# EAGLE schematic madrack (EAGLE 9.3.1)
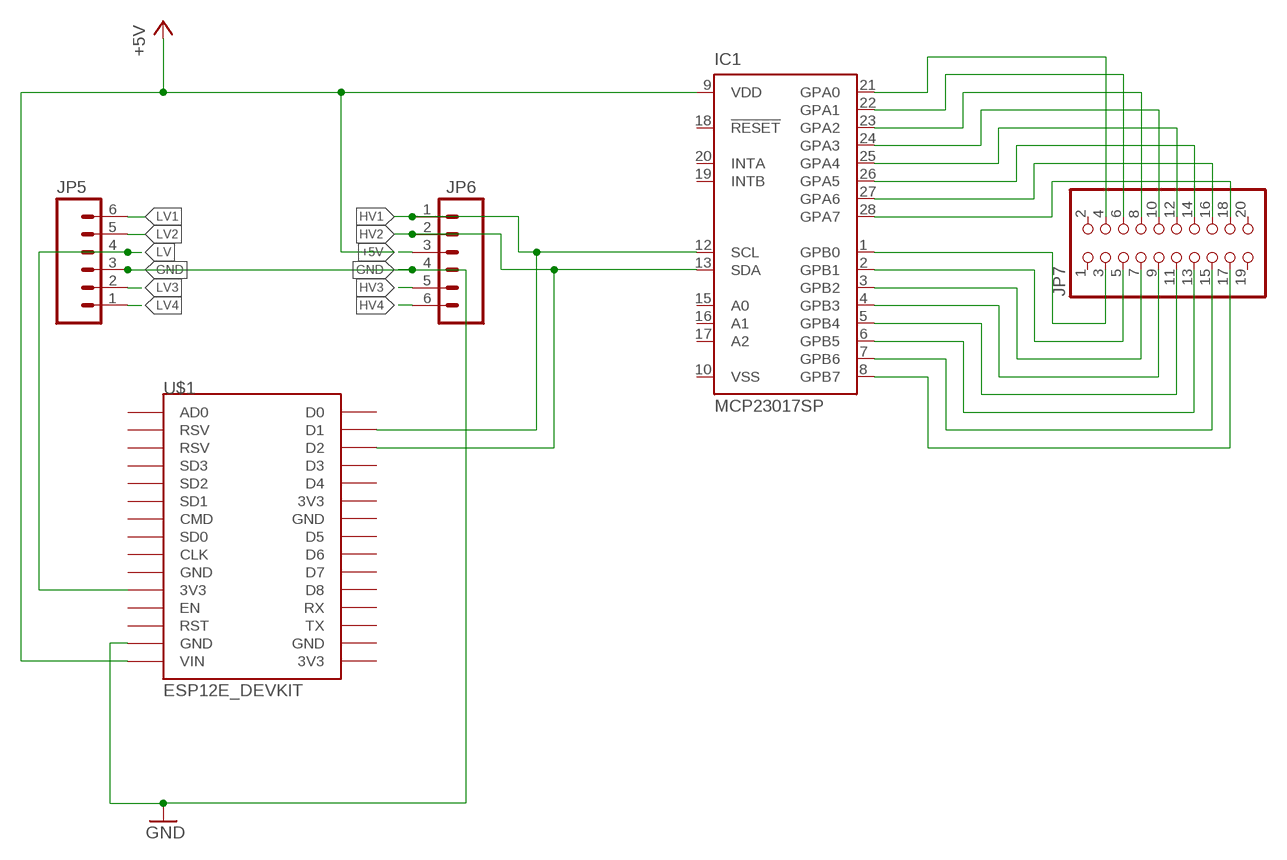
[diagram p0: schematic, sheet 1]

## Parts
IC1  MCP23017SP  [DIL28-3]
JP5  M06SIP  [1X06]
JP6  M06SIP  [1X06]
JP7  PINHD-2X10  [2X10]
U$1  ESP12E_DEVKIT  [ESP12E_DEVKIT]

## Nets
+5V: IC1.9(VDD) JP6.3 U$1.VIN
GND: JP5.3 JP6.4 U$1.GND@1(GND)
HV1: IC1.12(SCL) JP6.1 U$1.D1
HV2: IC1.13(SDA) JP6.2 U$1.D2
HV3: JP6.5
HV4: JP6.6
LV: JP5.4 U$1.3V3@0(3V3)
LV1: JP5.6
LV2: JP5.5
LV3: JP5.2
LV4: JP5.1
N$1: IC1.28(GPA7) JP7.18
N$2: IC1.27(GPA6) JP7.16
N$3: IC1.26(GPA5) JP7.14
N$4: IC1.25(GPA4) JP7.12
N$5: IC1.24(GPA3) JP7.10
N$6: IC1.23(GPA2) JP7.8
N$7: IC1.22(GPA1) JP7.6
N$8: IC1.21(GPA0) JP7.4
N$9: IC1.1(GPB0) JP7.3
N$10: IC1.2(GPB1) JP7.5
N$11: IC1.3(GPB2) JP7.7
N$12: IC1.4(GPB3) JP7.9
N$13: IC1.5(GPB4) JP7.11
N$14: IC1.6(GPB5) JP7.13
N$15: IC1.7(GPB6) JP7.15
N$16: IC1.8(GPB7) JP7.17
Unconnected: IC1.15(A0) IC1.16(A1) IC1.17(A2) IC1.18(!RESET) IC1.19(INTB) IC1.20(INTA) JP7.1 JP7.2 JP7.19 JP7.20 U$1.3V3@1(3V3) U$1.3V3@2(3V3) U$1.AD0 U$1.CLK U$1.CMD U$1.D0 U$1.D3 U$1.D4 U$1.D5 U$1.D6 U$1.D7 U$1.D8 U$1.EN U$1.GND@0(GND) U$1.GND@2(GND) U$1.GND@3(GND) U$1.RST U$1.RSV@0(RSV) U$1.RSV@1(RSV) U$1.RX U$1.SD0 U$1.SD1 U$1.SD2 U$1.SD3 U$1.TX

## Power pins joined to a net without a drawn wire
VSS: IC1.10(VSS)

## Library data of the parts
IC1 = adafruit:MCP23017: http://ww1.microchip.com/downloads/en/DeviceDoc/21952a.pdf Source: http://ww1.microchip.com/downloads/en/DeviceDoc/21952a.pdf
JP5 JP6 = SparkFun:M06: Header 6 Standard 6-pin 0.1" header. Use with straight break away headers (SKU : PRT-00116), right angle break away headers (PRT-00553), swiss pins (PRT-00743), machine pins (PRT-00117), and female headers (PRT-00115). Molex polarized connector foot print use with SKU : PRT-08094 with associated crimp pins and housings. NOTES ON THE VARIANTS LOCK and LOCK_LONGPADS... This footprint was designed to help hold the alignment of a through-hole component (i.e. 6-pin header) while soldering it into place. You may notice that each hole has been shifted either up or down by 0.005 of an inch from it's more standard position (which is a perfectly straight line). This slight alteration caused the pins (the squares in the middle) to touch the edges of the holes. Because they are alternating, it causes a "brace" to hold the component in place. 0.005 has proven to be the perfect amount of "off-center" position when using our standard breakaway headers. Although looks a little odd when you look at the bare footprint, once you have a header in there, the alteration is very hard to notice. Also, if you push a header all the way into place, it is covered up entirely on the bottom side. This idea of altering the position of holes to aid alignment will be further integrated into the Sparkfun Library for other footprints. It can help hold any component with 3 or more connection pins.
JP7 = pinhead:PINHD-2X10: PIN HEADER
U$1 = ESP12E_DEVKIT:ESP12E_DEVKIT: ESP12E DEVKIT BOARD